# EasyEDA Pro project PCB.eprj, schematic Output_Register
Board Name: Output_Register; Create Date: 2025-08-13; Page Name: P1; Project Name: PCB; Schematic Name: Output_Register; Update Date: 2025-08-13; Company: EasyEDA.com; Page Size: A4; Version: V1.0
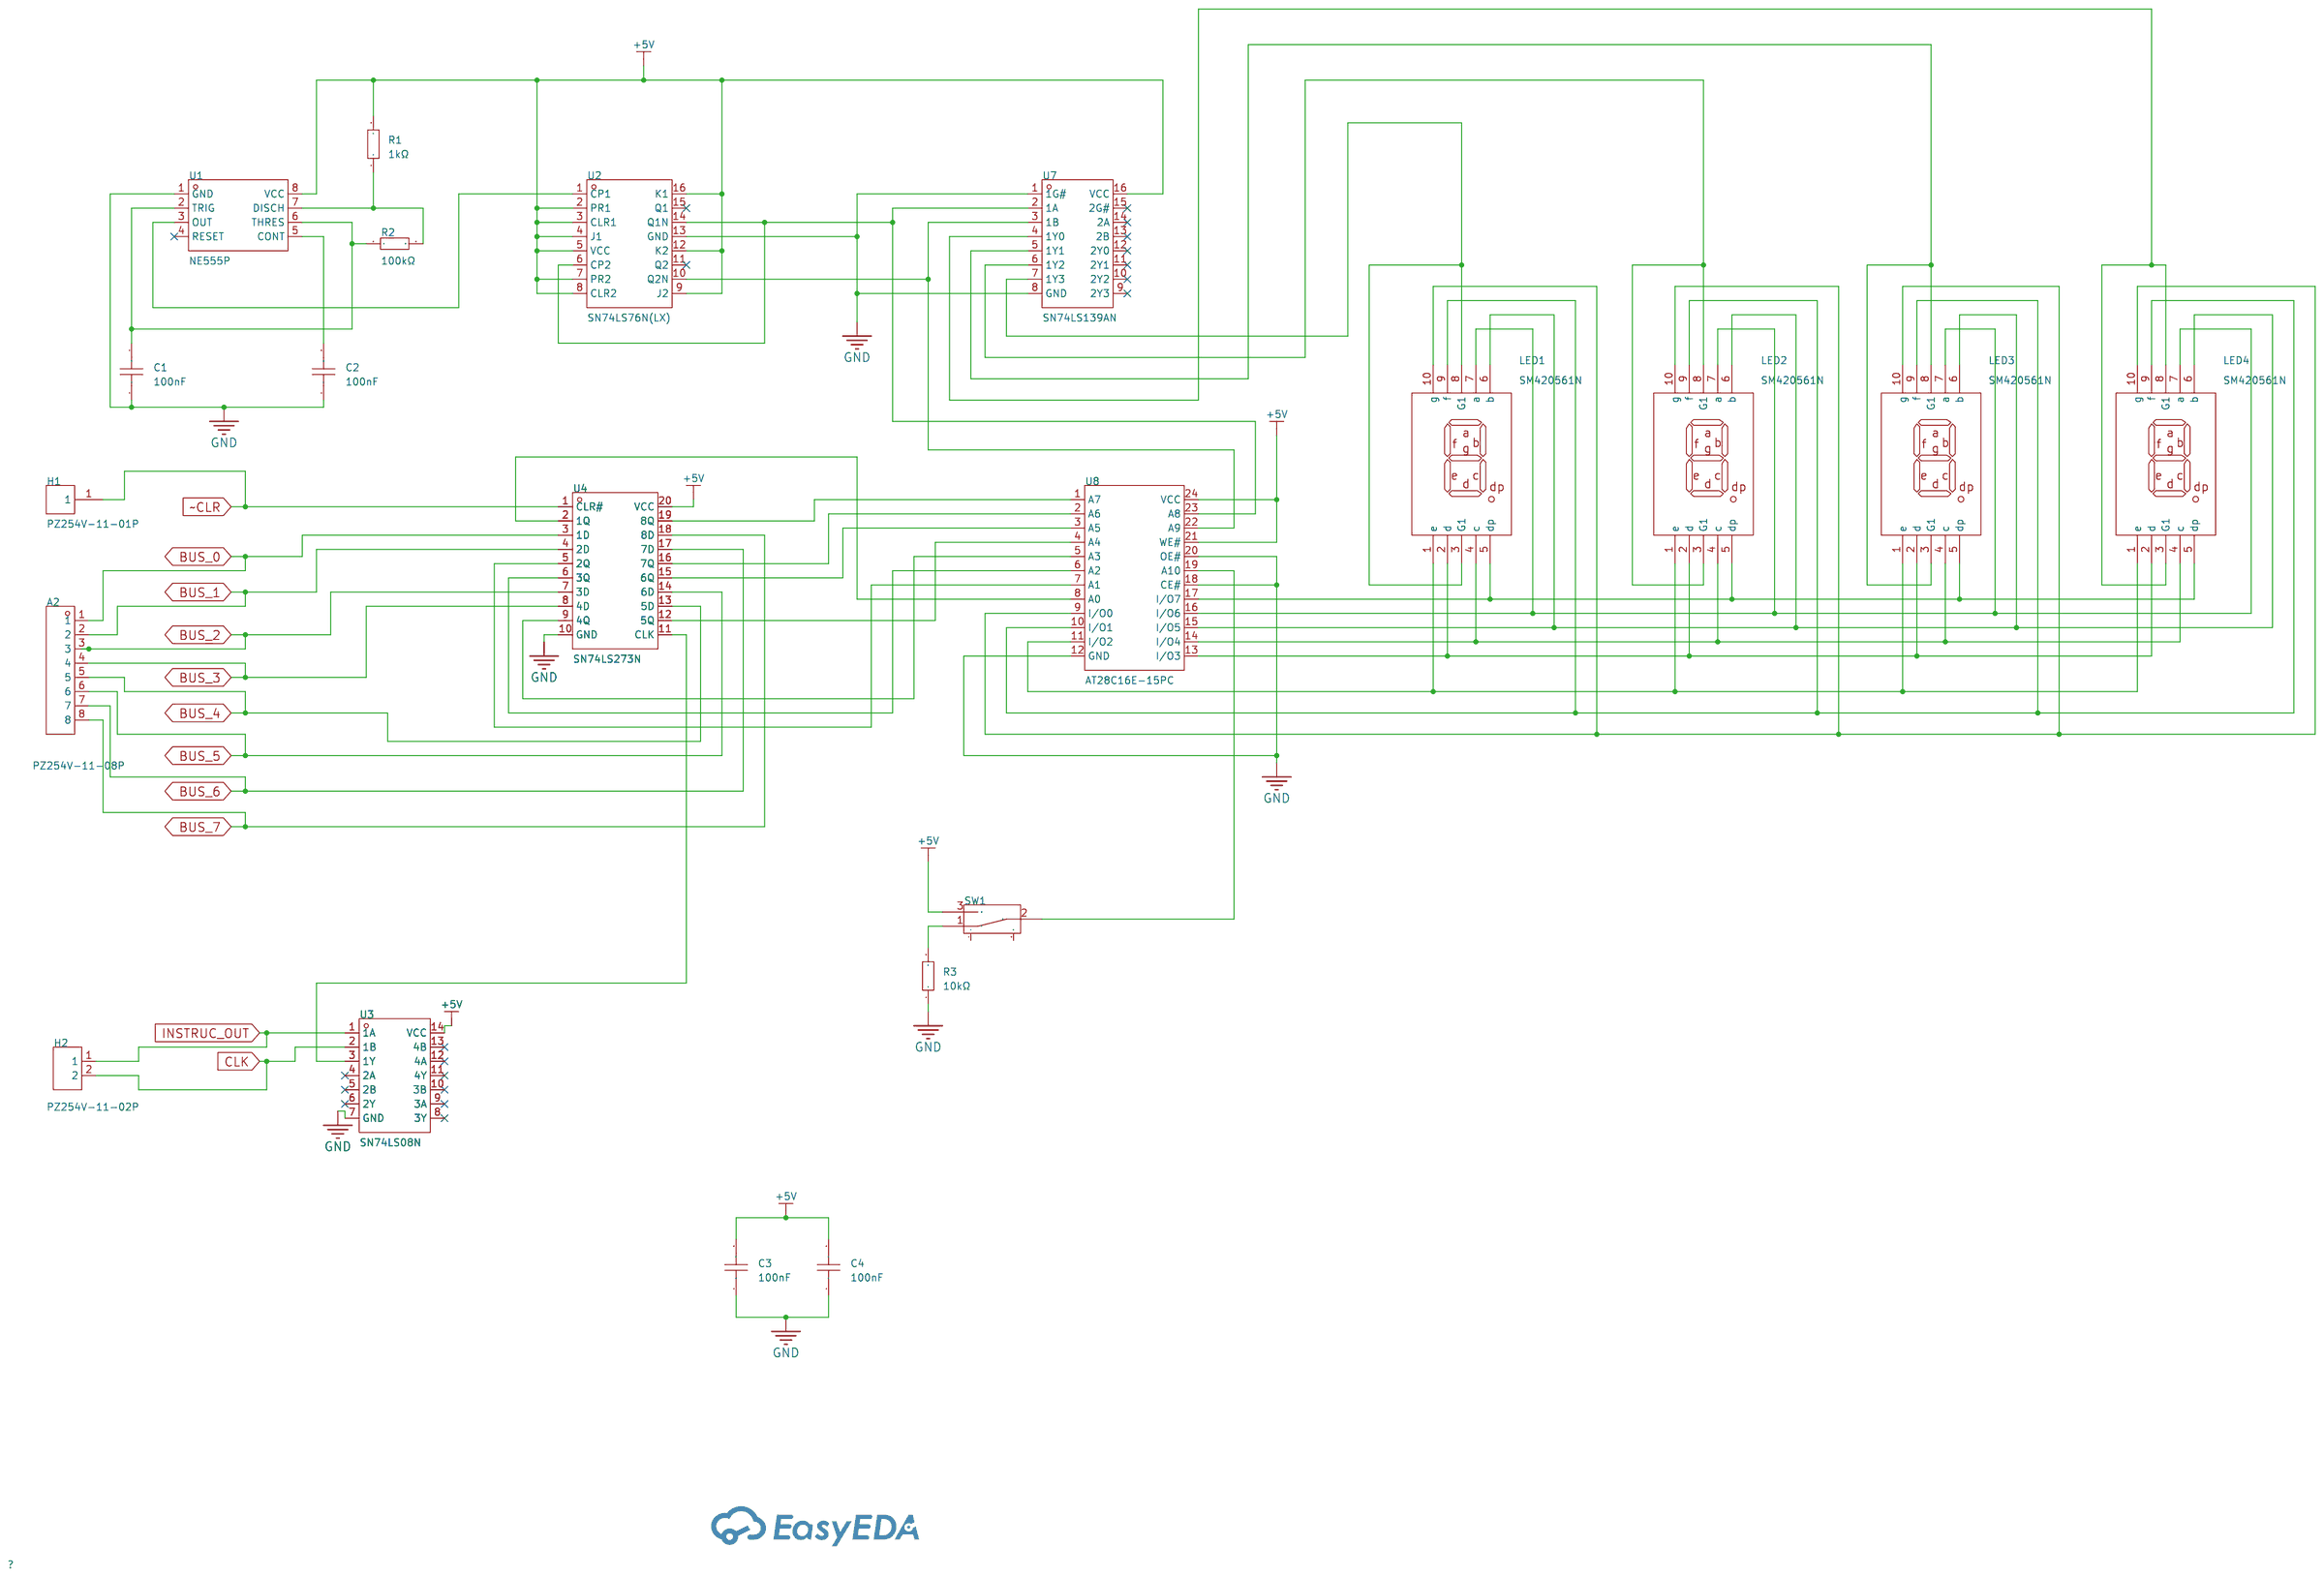
[diagram p6: schematic sheet]

## Parts
A2  PZ254V-11-08P  [HDR-TH_8P-P2.54-V-M]
C1  100nF  [CAP-TH_L8.5-W5.0-P5.00-D1.2]
C2  100nF  [CAP-TH_L8.5-W5.0-P5.00-D1.2]
C3  100nF  [CAP-TH_L8.5-W5.0-P5.00-D1.2]
C4  100nF  [CAP-TH_L8.5-W5.0-P5.00-D1.2]
H1  PZ254V-11-01P  [HDR-TH_1P-P2.54-V-M]
H2  PZ254V-11-02P  [HDR-TH_2P-P2.54-V-M]
LED1  SM420561N  [LED-SEG-TH_10P-L12.7-W19.0-P2.54-S15.24-BL]
LED2  SM420561N  [LED-SEG-TH_10P-L12.7-W19.0-P2.54-S15.24-BL]
LED3  SM420561N  [LED-SEG-TH_10P-L12.7-W19.0-P2.54-S15.24-BL]
LED4  SM420561N  [LED-SEG-TH_10P-L12.7-W19.0-P2.54-S15.24-BL]
R1  1kΩ  [R_AXIAL-0.4]
R2  100kΩ  [R_AXIAL-0.4]
R3  10kΩ  [R_AXIAL-0.4]
SW1  -  [SW-TH_SK12D07VG3]
U1  NE555P  [DIP-8_L9.8-W6.6-P2.54-LS7.6-BL]
U2  SN74LS76N(LX)  [PDIP-16_L19.3-W6.4-P2.54-LS7.94-BL]
U3  SN74LS08N  [PDIP-14_L19.3-W6.4-P2.54-LS7.9-BL-1]
U4  SN74LS273N  [PDIP-20_L25.4-W6.4-P2.54-LS7.6-BL]
U7  SN74LS139AN  [PDIP-16_L19.3-W6.4-P2.54-LS7.9-BL]
U8  AT28C16E-15PC  [PDIP-24_L31.0-W13.5-P2.54-LS15.2-BL]

## Library data of the parts
A2 = PZ254V-11-08P: LCSC Part Name: 间距:2.54mm 1x8P 直插 方针; Supplier Part: C492407; Manufacturer: XFCN(兴飞); Supplier Footprint: 插件,P=2.54mm; JLCPCB Part Class: Extended Part; Datasheet: https://atta.szlcsc.com/upload/public/pdf/source/20200309/C492407_83A6FB26A2233368EDB9516968EC6149.pdf; Supplier: LCSC; Pin Structure: 1x8P; Pitch: 2.54mm; Circluar Pins/Square Pins: Square Pins; Mounting Type: Straight; Number of Rows: Plugin; Number of Pins: 8P; Length of Mating Pin: 6mm; Insulation Height: 2.5mm; Length of End Connection Pin: 3mm; Operating Temperature Range: -40℃~+105℃; Color: Black
C1-C4 = CT4-0805B104K500F3: LCSC Part Name: 100nF ±10% 50V C3型（直脚）; Supplier Part: C84772; Manufacturer: FH(风华); Supplier Footprint: 插件,P=5.08mm; JLCPCB Part Class: Extended Part; Datasheet: https://atta.szlcsc.com/upload/public/pdf/source/20190402/C385200_059806A6312B28FF1421A2413EB641E1.pdf; Supplier: LCSC; Tolerance: ±10%
H1 = PZ254V-11-01P: LCSC Part Name: 1x1P 间距:2.54mm 方针 直插; Supplier Part: C492400; Manufacturer: XFCN(兴飞); Supplier Footprint: 插件,P=2.54mm; JLCPCB Part Class: Extended Part; Datasheet: https://atta.szlcsc.com/upload/public/pdf/source/20200309/C492400_46876A5B545F5AE6B8D4A09C46E276E8.pdf; Supplier: LCSC; Pin Structure: 1x1P; Pitch: 2.54mm; Circluar Pins/Square Pins: Policy; Mounting Type: Straight; Number of Rows: Single Row; Number of Pins: 1P; Length of Mating Pin: 6mm; Insulation Height: 2.5mm; Length of End Connection Pin: 3mm; Contact Material: Brass; Operating Temperature: -40℃~+105℃; Color: Black
H2 = PZ254V-11-02P: LCSC Part Name: 1x2P 间距:2.54mm 方针 直插; Supplier Part: C492401; Manufacturer: XFCN(兴飞); Supplier Footprint: 插件,P=2.54mm; JLCPCB Part Class: Extended Part; Datasheet: https://atta.szlcsc.com/upload/public/pdf/source/20200309/C492401_A812433581A9B211A7FFA413ADDFF0E5.pdf; Supplier: LCSC; Pin Structure: 1x2P; Pitch: 2.54mm; Circluar Pins/Square Pins: Policy; Mounting Type: Straight; Number of Rows: Single Row; Number of Pins: 2P; Length of Mating Pin: 6mm; Insulation Height: 2.5mm; Length of End Connection Pin: 3mm; Contact Material: Brass; Operating Temperature: -40℃~+105℃; Color: Black
LED1-LED4 = SM420561N: Number of Characters:1Bit Display Type:7段 Module Size:19mmx12.6mmx8mm Power Dissipation:50mW Luminous Color:Red LED Polarity:共阴极 Digit/Alpha Size(inch):0.56; LCSC Part Name: 1位0.56英寸红色数码管 共阴极; Supplier Part: C141367; Manufacturer: ARKLED(方舟); Supplier Footprint: 插件; JLCPCB Part Class: Extended Part; Datasheet: https://atta.szlcsc.com/upload/public/pdf/source/20171116/C141367_15108221483041123770.pdf; Supplier: LCSC; Number of Characters: 1Bit; Display Type: 7段; Module Size: 19mmx12.6mmx8mm; Power Dissipation: 50mW; Luminous Color: Red; LED Polarity: 共阴极; Digit/Alpha Size(inch): 0.56
R1-R3 = Res_AXIAL-1/4W: Supplier Footprint: Through
SW1 = SK12D07VG3: Supplier Footprint: Through
U1 = NE555P: Supplier Part: C46749; Manufacturer: TI(德州仪器); Supplier Footprint: DIP-8; JLCPCB Part Class: Extended Part; Datasheet: https://www.ti.com/cn/lit/gpn/ne555; Supplier: LCSC
U2 = SN74LS76N(LX): Type:JK-Type Trigger Type:Falling Edge Voltage - Supply:2V~6V Voltage - Supply:2V~6V Clock Frequency:28MHz Output Type:Push-Pull Propagation Delay:- Series:74LS Series Quiescent Current:2uA Operating Temperature:-40℃~+125℃ Operating Temperature:-40℃~+125℃; Supplier Part: C41432856; Manufacturer: LX(灵星芯微); Supplier Footprint: DIP-16; Datasheet: https://atta.szlcsc.com/upload/public/pdf/source/20241021/03E57047579D06EC809D279D7674BE8E.pdf; Supplier: LCSC; Type: JK-Type; Trigger Type: Falling Edge; Voltage - Supply: 2V~6V; Clock Frequency: 28MHz; Output Type: Push-Pull; Series: 74LS Series; Quiescent Current: 2uA; Operating Temperature: -40℃~+125℃
U3 = SN74LS08N: Supplier Part: C2869595; Manufacturer: TI(德州仪器); Supplier Footprint: PDIP-14; JLCPCB Part Class: Extended Part; Datasheet: https://www.ti.com/cn/lit/gpn/sn54s08; Supplier: LCSC; Logic Type: AND Gate; Number of Channels: 4; Voltage - Supply: 4.75V~5.25V; Current - Output Low(IOL): 8mA; Current - Output High(IOH): 400uA; Input Logic Level - High: 2V; Input Logic Level - Low: 800mV; Series: 74LSSeries; Operating Temperature: 0℃~+70℃
U4 = SN74LS273N: Type:D-Type Trigger Type:Rising Edge Voltage - Supply:4.75V~5.25V Voltage - Supply:4.75V~5.25V Clock Frequency:40MHz Function:Reset Number of Elements:1 Number of Bits per Element:8 Output Type:- Propagation Delay:27ns@5V,15pF Series:74LS Series Current -; Supplier Part: C2879026; Manufacturer: TI(德州仪器); Supplier Footprint: PDIP-20; JLCPCB Part Class: Extended Part; Datasheet: https://www.ti.com/cn/lit/gpn/sn54ls273; Supplier: LCSC; Type: D-Type; Trigger Type: Rising Edge; Voltage - Supply: 4.75V~5.25V; Clock Frequency: 40MHz; Function: Reset; Number of Elements: 1; Number of Bits per Element: 8; Propagation Delay: 27ns@5V,15pF; Series: 74LS Series; Current - Output Low(IOL): 8mA; Current - Output High(IOH): 400uA; Quiescent Current: 27mA; Operating Temperature: 0℃~+70℃
U7 = SN74LS139AN: Type:Decoder/Demultiplexer Voltage Supply Source:Single Supply Voltage - Supply:4.75V~5.25V Voltage - Supply:4.75V~5.25V Current - Output Low(IOL):8mA Current - Output High(IOH):400uA Operating temperature:0℃~+70℃ Operating temperature:0℃~+70℃; Supplier Part: C1547281; Manufacturer: TI(德州仪器); Supplier Footprint: PDIP-16; JLCPCB Part Class: Extended Part; Datasheet: https://www.ti.com/cn/lit/gpn/sn74ls139a; Supplier: LCSC; Type: Decoder/Demultiplexer; Voltage Supply Source: Single Supply; Voltage - Supply: 4.75V~5.25V; Current - Output Low(IOL): 8mA; Current - Output High(IOH): 400uA; Operating temperature: 0℃~+70℃
U8 = AT28C16E-15PC: Supplier Part: C19393057; Manufacturer: MICROCHIP(美国微芯); Supplier Footprint: PDIP-24; JLCPCB Part Class: Extended Part; Datasheet: https://atta.szlcsc.com/upload/public/pdf/source/20231219/98B154FA288F53C07025EE50A49045E4.pdf; Supplier: LCSC

## Nets
+5V: C3.2 C4.2 R1.2 SW1.3 U1.8(VCC) U2.2(PR1) U2.3(CLR1) U2.4(J1) U2.5(VCC) U2.7(PR2) U2.8(CLR2) U2.9(J2) U2.12(K2) U2.16(K1) U3.14(VCC) U4.20(VCC) U7.16(VCC) U8.21(WE#) U8.24(VCC)
GND: C1.1 C2.1 C3.1 C4.1 R3.1 U1.1(GND) U2.13(GND) U3.7(GND) U4.10(GND) U7.1(1G#) U7.8(GND) U8.12(GND) U8.18(CE#) U8.20(OE#)
BUS_0: A2.1 U4.3(1D)
BUS_1: A2.2 U4.4(2D)
BUS_2: A2.3 U4.7(3D)
BUS_3: A2.4 U4.8(4D)
BUS_4: A2.5 U4.13(5D)
BUS_5: A2.6 U4.14(6D)
BUS_6: A2.7 U4.17(7D)
BUS_7: A2.8 U4.18(8D)
CLK: H2.2 U3.2(1B)
INSTRUC_OUT: H2.1 U3.1(1A)
~CLR: H1.1 U4.1(CLR#)
Net-(C1-2): C1.2 R2.1 U1.2(TRIG) U1.6(THRES)
Net-(C2-2): C2.2 U1.5(CONT)
Net-(LED1-1): LED1.1(e) LED2.1(e) LED3.1(e) LED4.1(e) U8.11(I/O2)
Net-(LED1-2): LED1.2(d) LED2.2(d) LED3.2(d) LED4.2(d) U8.13(I/O3)
Net-(LED1-3): LED1.3(G1) LED1.8(G1) U7.7(1Y3)
Net-(LED1-4): LED1.4(c) LED2.4(c) LED3.4(c) LED4.4(c) U8.14(I/O4)
Net-(LED1-5): LED1.5(dp) LED2.5(dp) LED3.5(dp) LED4.5(dp) U8.17(I/O7)
Net-(LED1-6): LED1.6(b) LED2.6(b) LED3.6(b) LED4.6(b) U8.15(I/O5)
Net-(LED1-7): LED1.7(a) LED2.7(a) LED3.7(a) LED4.7(a) U8.16(I/O6)
Net-(LED1-9): LED1.9(f) LED2.9(f) LED3.9(f) LED4.9(f) U8.10(I/O1)
Net-(LED1-10): LED1.10(g) LED2.10(g) LED3.10(g) LED4.10(g) U8.9(I/O0)
Net-(LED2-3): LED2.3(G1) LED2.8(G1) U7.6(1Y2)
Net-(LED3-3): LED3.3(G1) LED3.8(G1) U7.5(1Y1)
Net-(LED4-3): LED4.3(G1) LED4.8(G1) U7.4(1Y0)
Net-(R1-1): R1.1 R2.2 U1.7(DISCH)
Net-(R3-2): R3.2 SW1.1
Net-(SW1-2): SW1.2 U8.19(A10)
Net-(U1-3): U1.3(OUT) U2.1(CP1)
Net-(U2-6): U2.6(CP2) U2.14(Q1N) U7.2(1A) U8.23(A8)
Net-(U2-10): U2.10(Q2N) U7.3(1B) U8.22(A9)
Net-(U3-3): U3.3(1Y) U4.11(CLK)
Net-(U4-2): U4.2(1Q) U8.8(A0)
Net-(U4-5): U4.5(2Q) U8.7(A1)
Net-(U4-6): U4.6(3Q) U8.6(A2)
Net-(U4-9): U4.9(4Q) U8.5(A3)
Net-(U4-12): U4.12(5Q) U8.4(A4)
Net-(U4-15): U4.15(6Q) U8.3(A5)
Net-(U4-16): U4.16(7Q) U8.2(A6)
Net-(U4-19): U4.19(8Q) U8.1(A7)

Not connected (* = marked no-connect by the designer): SW1 4 5; U1 4(RESET)*; U2 11(Q2)* 15(Q1)*; U3 4(2A)* 5(2B)* 6(2Y)* 8(3Y)* 9(3A)* 10(3B)* 11(4Y)* 12(4A)* 13(4B)*; U7 9(2Y3)* 10(2Y2)* 11(2Y1)* 12(2Y0)* 13(2B)* 14(2A)* 15(2G#)*
